# Altium schematic sheet BatUSBSwitchRev2.SchDoc
size A
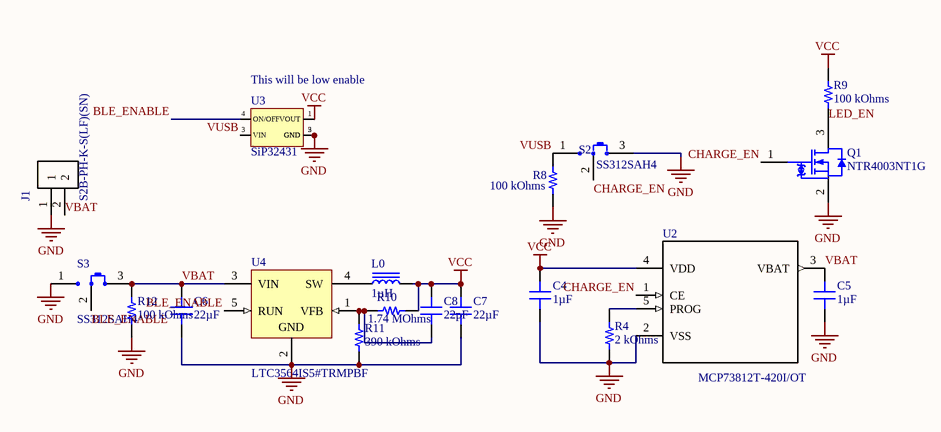
[diagram p0: BatUSBSwitchRev2.SchDoc]

## Parts
C4  1µF  [CAP 0805_2012]
C5  1µF  [CAP 0805_2012]
C6  22µF  [CAP 0805_2012]
C7  22µF  [CAP 0805_2012]
C8  22pF  [CAP 0805_2012]
J1  S2B-PH-K-S(LF)(SN)  [JST_S2B-PH-K-S(LF)(SN)]
L0  1µH  [IND 0806_2016]
Q1  NTR4003NT1G  [ONSC-SOT-23-3-318-08_V]
R4  2 kOhms  [RES 0805_2012]
R8  100 kOhms  [RES 0805_2012]
R9  100 kOhms  [RES 0805_2012]
R10  1.74 MOhms  [RES 0805_2012]
R11  390 kOhms  [RES 0805_2012]
R12  100 kOhms  [RES 0805_2012]
S2  SS312SAH4  [NKK SS312SAH4]
S3  SS312SAH4  [NKK SS312SAH4]
U2  MCP73812T-420I/OT  [*SOT95P270X145-5N]
U3  SiP32431  [SiP32431_TDFN4]
U4  LTC3564IS5#TRMPBF  [LT-S5-5-TSOT-23_N]

## Nets
GND: C4.1 C5.1 C6.1 C7.1 J1.1 Q1.2(S) R4.1 R8.1 R11.1 R12.1 S2.3 S3.1 U2.2(VSS) U3.2(GND) U3.5(GND) U4.2(GND)
VCC: C4.2 C7.2 C8.2 L0.2 R9.2 R10.2 U2.4(VDD) U3.1(VOUT)
BLE_ENABLE: S3.2(COM) U3.4(ON/OFF) U4.5(RUN)
CHARGE_EN: Q1.1(G) S2.2(COM) U2.1(CE)
LED_EN: Q1.3(D) R9.1
VBAT: C5.2 C6.2 J1.2 R12.2 S3.3 U2.3(VBAT) U4.3(VIN)
VUSB: R8.2 S2.1 U3.3(VIN)
NetC8_1: C8.1 R10.1 R11.2 U4.1(VFB)
NetL0_1: L0.1 U4.4(SW)
NetR4_2: R4.2 U2.5(PROG)

## Notes on the sheet
- (near U3) This will be low enable

## Library data of the parts
C4 C5 = GRM219R7YA105KA12D: CAP CER 1UF 35V X7R 0805; Manufacturer: Murata Electronics; Tolerance: ±10%; Part Number: GRM219R7YA105KA12D; Value: 1µF; Applications: General Purpose; Capacitance: 1µF; ComponentLink1Description: Datasheet; ComponentLink1URL: https://search.murata.co.jp/Ceramy/image/img/A01X/G101/ENG/GRM219R7YA105KA12-01.pdf; ComponentLink2Description: DigiKey Link; ComponentLink2URL: http://digikey.com/product-detail/en/murata-electronics/GRM219R7YA105KA12D/490-10494-1-ND/5026417; Device Package: 0805 (2012 Metric); LastUpdated: 1/21/2020 12:02:41 AM; Lifecycle Status: Active; Minimum Order: 1; Mounting Type: Surface Mount, MLCC; Operating Temperature: -55°C ~ 125°C; Package / Case: 0805 (2012 Metric); Packaging: TapeAndReel; PartId: 16877; Part Status: Active; Price: 0.05; Series: GRM; Size / Dimension: 0.079" L x 0.049" W (2.00mm x 1.25mm); Supplier 1: DigiKey; Supplier Part Number 1: 490-10494-1-ND; Temperature Coefficient: X7R; Thickness (Max): 0.037" (0.95mm); Voltage - Rated: 35V
C6 C7 = GRM21BR60J226ME39K: CAP CER 22UF 6.3V X5R 0805; Manufacturer: Murata Electronics; Tolerance: ±20%; Part Number: GRM21BR60J226ME39K; Value: 22µF; Applications: General Purpose; Capacitance: 22µF; ComponentLink1Description: Datasheet; ComponentLink1URL: https://search.murata.co.jp/Ceramy/image/img/A01X/G101/ENG/GRM21BR60J226ME39-01.pdf; ComponentLink2Description: DigiKey Link; ComponentLink2URL: http://digikey.com/product-detail/en/murata-electronics/GRM21BR60J226ME39K/490-6471-1-ND/3845668; Device Package: 0805 (2012 Metric); LastUpdated: 1/21/2020 12:02:52 AM; Lifecycle Status: Active; Minimum Order: 1; Mounting Type: Surface Mount, MLCC; Operating Temperature: -55°C ~ 85°C; Package / Case: 0805 (2012 Metric); Packaging: TapeAndReel; PartId: 11540; Part Status: Active; Price: 0.09; Series: GRM; Size / Dimension: 0.079" L x 0.049" W (2.00mm x 1.25mm); Supplier 1: DigiKey; Supplier Part Number 1: 490-6471-1-ND; Temperature Coefficient: X5R; Thickness (Max): 0.053" (1.35mm); Voltage - Rated: 6.3V
C8 = GRM21A5C2E220JW01D: CAP CER 22PF 250V C0G/NP0 0805; Manufacturer: Murata Electronics; Temperature Coefficient: C0G, NP0; Tolerance: ±5%; Part Number: GRM21A5C2E220JW01D; Value: 22pF; Applications: General Purpose; Capacitance: 22pF; ComponentLink1Description: Datasheet; ComponentLink1URL: https://search.murata.co.jp/Ceramy/image/img/A01X/G101/ENG/GRM21A5C2E220JW01-01.pdf; ComponentLink2Description: DigiKey Link; ComponentLink2URL: http://digikey.com/product-detail/en/murata-electronics/GRM21A5C2E220JW01D/490-5534-1-ND/2334930; Device Package: 0805 (2012 Metric); LastUpdated: 1/21/2020 12:03:03 AM; Lifecycle Status: Active; Minimum Order: 1; Mounting Type: Surface Mount, MLCC; Operating Temperature: -55°C ~ 125°C; Package / Case: 0805 (2012 Metric); Packaging: TapeAndReel; PartId: 4520; Part Status: Active; Price: 0.07; Series: GRM; Size / Dimension: 0.079" L x 0.049" W (2.00mm x 1.25mm); Supplier 1: DigiKey; Supplier Part Number 1: 490-5534-1-ND; Thickness (Max): 0.039" (1.00mm); Voltage - Rated: 250V
J1 = S2B-PH-K-S(LF)(SN): PH Series 2 Position 2.0 mm Through Hole Side Entry Shrouded Header; MP: S2B-PH-K-S_LF__SN_; MF: JST Sales; SnapEDA_Link: https://www.snapeda.com/parts/S2B-PH-K-S%28LF%29%28SN%29/JST%20Sales%20America%20Inc./view-part/?ref=snap; Digi-Key_Part_Number: 455-1719-ND; Package: FakePackage u; Digi-Key_Purchase_URL: https://www.digikey.com/product-detail/en/jst-sales-america-inc/S2B-PH-K-S_LF__SN_/455-1719-ND/926626?utm_source=snapeda&utm_medium=aggregator&utm_campaign=symbol; Value: *
L0 = DFE201612E-1R0M=P2: FIXED IND 1UH 2.9A 48 MOHM SMD; Manufacturer: Murata Electronics; Current - Saturation: 4A; DC Resistance (DCR): 48mOhm Max; Inductance Frequency - Test: 1MHz; Material - Core: Metal; Shielding: Shielded; Tolerance: ±20%; Type: Wirewound; Part Number: DFE201612E-1R0M=P2; ComponentLink1Description: Datasheet; ComponentLink1URL: https://search.murata.co.jp/Ceramy/image/img/P02/J(E)TE243A-0006_DFE201612E_reference.pdf; ComponentLink2Description: DigiKey Link; ComponentLink2URL: http://digikey.com/product-detail/en/murata-electronics/DFE201612E-1R0M=P2/490-16593-1-ND/7595517; Current Rating (Amps): 2.9A; Device Package: 0806 (2016 Metric); Height - Seated (Max): 0.047" (1.20mm); Inductance: 1µH; LastUpdated: 1/21/2020 3:56:31 AM; Lifecycle Status: Active; Minimum Order: 1; Mounting Type: Surface Mount; Operating Temperature: -40°C ~ 125°C; Package / Case: 0806 (2016 Metric); Packaging: TapeAndReel; PartId: 2779; Part Status: Active; Price: 0.17; Series: DFE201612E; Size / Dimension: 0.079" L x 0.063" W (2.00mm x 1.60mm); Supplier 1: DigiKey; Supplier Part Number 1: 490-16593-1-ND; Supplier Device Package: 0806 (2016 Metric); Value: 1µH
Q1 = NTR4003NT1G: Small Signal MOSFET, 30 V, 0.56 A, Single N-Channe, 3-Pin SOT-23, Pb-Free, Tape and Reel; Manufacturer: On Semiconductor; VGS(th) Max (V): 1.4; Crss Typ (pF): 8.1; Channel Polarity: N Channel; Coss Typ (pF): 19.7; ID Max (A): 0.56; Ciss Typ (pF): 21; V(BR)DSS Min (V): 30; VGS Max (V): 20; PartNumber: NTR4003NT1G; ComponentLink1Description: Manufacturer URL; ComponentLink2Description: Datasheet; DatasheetVersion: Rev. 3; ComponentLink3URL: http://www.onsemi.cn/pub_link/Collateral/318-08.PDF; ComponentLink3Description: Package Specification; ComponentLink1URL: http://www.onsemi.com/; Packing: Tape and Reel; Package Type: SOT-23-3; Configuration: Single; ComponentLink2URL: http://www.onsemi.cn/pub_link/Collateral/NTR4003N-D.PDF; PackageVersion: Rev. AP, 11/2009; RoHS: Pb-Free; Mounting Technology: Surface Mount; PackageReference: SOT-23-3-318-08; PackageDescription: 3-Pin Small Outline Transistor, Body 2.92 x 1.3 mm, Pitch 0.95 mm
R4 = ERA-6AEB202V: RES 2K OHM 0.1% 1/8W 0805; Manufacturer: Panasonic Electronic Components; Power (Watts): 0.125W, 1/8W; Temperature Coefficient: ±25ppm/°C; Part Number: ERA-6AEB202V; Value: 2 kOhms; ComponentLink1Description: Datasheet; ComponentLink1URL: https://industrial.panasonic.com/cdbs/www-data/pdf/RDM0000/AOA0000C307.pdf; ComponentLink2Description: DigiKey Link; ComponentLink2URL: http://digikey.com/product-detail/en/panasonic-electronic-components/ERA-6AEB202V/P2.0KDACT-ND/1465954; Composition: Thin Film; Device Package: 0805 (2012 Metric); Features: Automotive AEC-Q200; Height - Seated (Max): 0.024" (0.60mm); LastUpdated: 1/21/2020 1:49:56 AM; Lifecycle Status: Active; Minimum Order: 1; Number of Terminations: 2; Operating Temperature: -55°C ~ 155°C; Package / Case: 0805 (2012 Metric); Packaging: TapeAndReel; PartId: 28084; Part Status: Active; Price: 0.04; Ratings: AEC-Q200; Resistance: 2 kOhms; Series: ERA-6A; Size / Dimension: 0.079" L x 0.049" W (2.00mm x 1.25mm); Supplier 1: DigiKey; Supplier Part Number 1: P2.0KDACT-ND; Supplier Device Package: 0805; Tolerance: ±0.1%
R8 R9 R12 = ERJ-6ENF1003V: RES SMD 100K OHM 1% 1/8W 0805; Manufacturer: Panasonic Electronic Components; Power (Watts): 0.125W, 1/8W; Temperature Coefficient: ±100ppm/°C; Part Number: ERJ-6ENF1003V; Value: 100 kOhms; ComponentLink1Description: Datasheet; ComponentLink1URL: https://industrial.panasonic.com/cdbs/www-data/pdf/RDA0000/AOA0000C304.pdf; ComponentLink2Description: DigiKey Link; ComponentLink2URL: http://digikey.com/product-detail/en/panasonic-electronic-components/ERJ-6ENF1003V/P100KCCT-ND/119551; Composition: Thick Film; Device Package: 0805 (2012 Metric); Features: Automotive AEC-Q200; Height - Seated (Max): 0.028" (0.70mm); LastUpdated: 1/21/2020 1:48:04 AM; Lifecycle Status: Active; Minimum Order: 1; Number of Terminations: 2; Operating Temperature: -55°C ~ 155°C; Package / Case: 0805 (2012 Metric); Packaging: TapeAndReel; PartId: 32252; Part Status: Active; Price: 0.01; Ratings: AEC-Q200; Resistance: 100 kOhms; Series: ERJ; Size / Dimension: 0.079" L x 0.049" W (2.00mm x 1.25mm); Supplier 1: DigiKey; Supplier Part Number 1: P100KCCT-ND; Supplier Device Package: 0805; Tolerance: ±1%
R10 = ERJ-6ENF1744V: RES SMD 1.74M OHM 1% 1/8W 0805; Manufacturer: Panasonic Electronic Components; Power (Watts): 0.125W, 1/8W; Temperature Coefficient: ±100ppm/°C; Part Number: ERJ-6ENF1744V; Value: 1.74 MOhms; ComponentLink1Description: Datasheet; ComponentLink1URL: https://industrial.panasonic.com/cdbs/www-data/pdf/RDA0000/AOA0000C304.pdf; ComponentLink2Description: DigiKey Link; ComponentLink2URL: http://digikey.com/product-detail/en/panasonic-electronic-components/ERJ-6ENF1744V/P1.74BTCT-ND/4429146; Composition: Thick Film; Device Package: 0805 (2012 Metric); Features: Automotive AEC-Q200; Height - Seated (Max): 0.028" (0.70mm); LastUpdated: 1/21/2020 1:44:32 AM; Lifecycle Status: Active; Minimum Order: 1; Number of Terminations: 2; Operating Temperature: -55°C ~ 155°C; Package / Case: 0805 (2012 Metric); Packaging: TapeAndReel; PartId: 40274; Part Status: Active; Price: 0.01; Ratings: AEC-Q200; Resistance: 1.74 MOhms; Series: ERJ; Size / Dimension: 0.079" L x 0.049" W (2.00mm x 1.25mm); Supplier 1: DigiKey; Supplier Part Number 1: P1.74BTCT-ND; Supplier Device Package: 0805; Tolerance: ±1%
R11 = ERA-6AEB394V: RES 390K OHM 0.1% 1/8W 0805; Manufacturer: Panasonic Electronic Components; Power (Watts): 0.125W, 1/8W; Temperature Coefficient: ±25ppm/°C; Part Number: ERA-6AEB394V; Value: 390 kOhms; ComponentLink1Description: Datasheet; ComponentLink1URL: https://industrial.panasonic.com/cdbs/www-data/pdf/RDM0000/AOA0000C307.pdf; ComponentLink2Description: DigiKey Link; ComponentLink2URL: http://digikey.com/product-detail/en/panasonic-electronic-components/ERA-6AEB394V/P390KDACT-ND/1466009; Composition: Thin Film; Device Package: 0805 (2012 Metric); Features: Automotive AEC-Q200; Height - Seated (Max): 0.024" (0.60mm); LastUpdated: 1/21/2020 1:39:37 AM; Lifecycle Status: Active; Minimum Order: 1; Number of Terminations: 2; Operating Temperature: -55°C ~ 155°C; Package / Case: 0805 (2012 Metric); Packaging: TapeAndReel; PartId: 48815; Part Status: Active; Price: 0.04; Ratings: AEC-Q200; Resistance: 390 kOhms; Series: ERA-6A; Size / Dimension: 0.079" L x 0.049" W (2.00mm x 1.25mm); Supplier 1: DigiKey; Supplier Part Number 1: P390KDACT-ND; Supplier Device Package: 0805; Tolerance: ±0.1%
S2 S3 = SS312SAH4: SWITCH SLIDE SPDT 0.4VA 28V; Manufacturer: NKK Switches; Actuator Length: 2.00mm; Actuator Type: Standard; Contact Timing: Shorting (MBB); Current Rating (Amps): 0.4VA (AC/DC); Switch Function: On-On; Part Number: SS312SAH4; Circuit: SPDT; ComponentLink1Description: Datasheet; ComponentLink1URL: http://www.nkkswitches.com/pdf/SS3surfaceMount-1.pdf; ComponentLink2Description: DigiKey Link; ComponentLink2URL: http://digikey.com/product-detail/en/nkk-switches/SS312SAH4/360-3250-ND/1052031; Contact Finish: Gold; Contact Material: Phosphor Bronze; LastUpdated: 1/4/2020 7:15:23 PM; Lifecycle Status: Active; Minimum Order: 1; Mounting Type: Surface Mount, Right Angle; Operating Temperature: -25°C ~ 85°C; Packaging: Tray; PartId: 2; Part Status: Active; Price: 3.02; Series: SS3; Supplier 1: DigiKey; Supplier Part Number 1: 360-3250-ND; Termination Style: Gull Wing; Voltage Rating - AC: 28V; Voltage Rating - DC: 28V
U2 = MCP73812T-420I/OT: Sot23 Simple Low-Cost Integrated Li-Ion/Li-Poly Charge Mgnt Controller, 4.2v Vre; MF: Microchip; Price: None; SnapEDA_Link: https://www.snapeda.com/parts/MCP73812T-420I/OT/Microchip/view-part/?ref=snap; Availability: Unavailable; MP: MCP73812T-420I/OT; Package: SOT-23 Microchip; Value: *
U3 = SiP32431: Ultra low quiescent current load switch, low enable
U4 = LTC3564IS5#TRMPBF: 2.25 MHz, 1.25 A Synchronous Step-Down Regulator, 5-pin SOT23 (S5-5), -40 to 125 degC, Pb-Free, Mini Tape and Reel; Manufacturer: Linear Technology; Number of Outputs: 1; ComponentLink1Description: Manufacturer URL; ComponentLink2Description: Datasheet; ComponentLink3Description: Package Specification; Mounting Technology: Surface Mount; ComponentLink3URL: http://cds.linear.com/docs/en/packaging/SOT_5_05-08-1635.pdf; ComponentLink1URL: http://www.linear.com/; Code_JEDEC: MO-193; Packing: Mini Tape and Reel; PackageVersion: Jun-10; RoHS: TRUE; PartNumber: LTC3564IS5#TRMPBF; PackageReference: S5-5; PackageDescription: 5-Pin Plastic TSOT-23, Body 1.63 x 2.90 mm, Pitch 0.95 mm; ComponentLink2URL: http://cds.linear.com/docs/en/datasheet/3564f.pdf